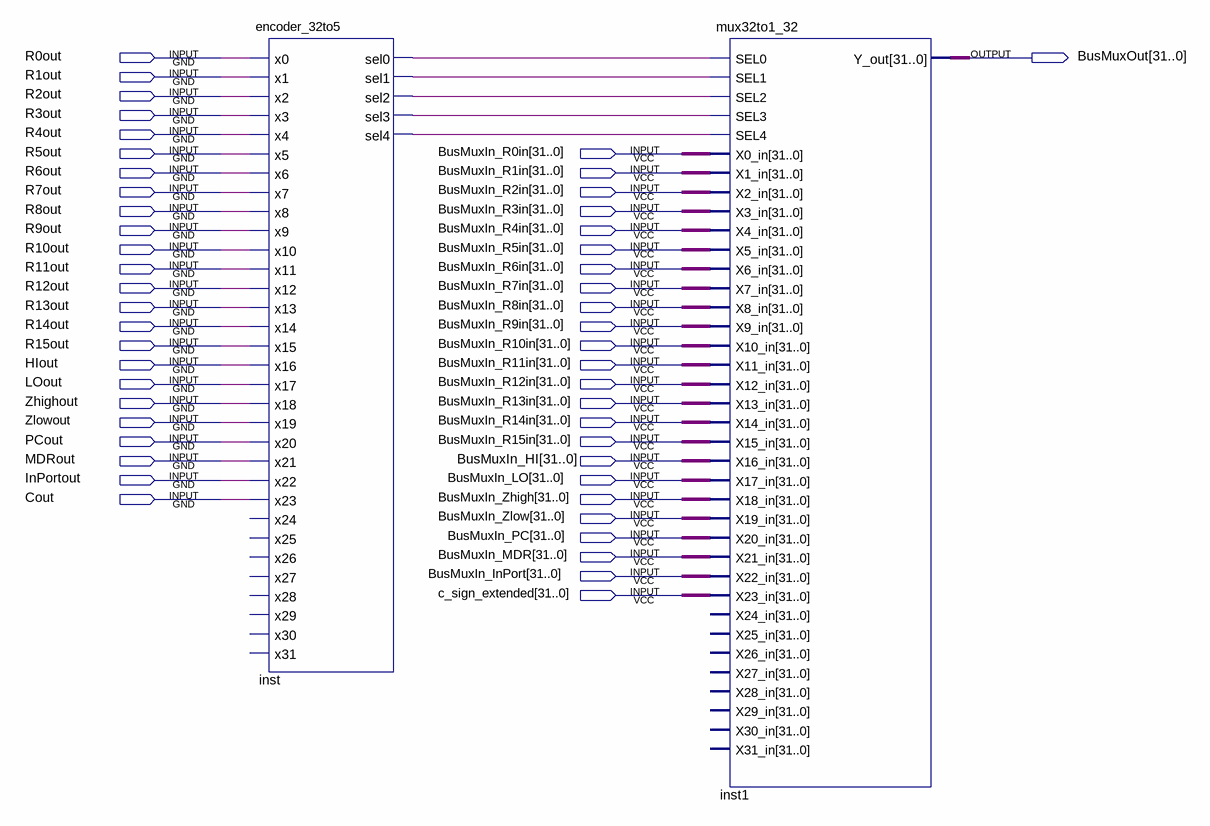
[diagram p0: schematic sheet]
// Quartus schematic bidirectional_bus_design.bdf as structural Verilog: 2 symbols, 49 pins
module bidirectional_bus_design (
  input  R0out,
  input  R1out,
  input  R2out,
  input  R3out,
  input  R4out,
  input  R5out,
  input  [31:0] BusMuxIn_R0in,
  input  R6out,
  input  [31:0] BusMuxIn_R1in,
  input  R7out,
  input  [31:0] BusMuxIn_R2in,
  input  R8out,
  input  [31:0] BusMuxIn_R3in,
  input  R9out,
  input  [31:0] BusMuxIn_R4in,
  input  R10out,
  input  [31:0] BusMuxIn_R5in,
  input  R11out,
  input  [31:0] BusMuxIn_R6in,
  input  R12out,
  input  [31:0] BusMuxIn_R7in,
  input  R13out,
  input  [31:0] BusMuxIn_R8in,
  input  R14out,
  input  [31:0] BusMuxIn_R9in,
  input  R15out,
  input  [31:0] BusMuxIn_R10in,
  input  HIout,
  input  [31:0] BusMuxIn_R11in,
  input  LOout,
  input  [31:0] BusMuxIn_R12in,
  input  Zhighout,
  input  [31:0] BusMuxIn_R13in,
  input  Zlowout,
  input  [31:0] BusMuxIn_R14in,
  input  PCout,
  input  [31:0] BusMuxIn_R15in,
  input  MDRout,
  input  [31:0] BusMuxIn_HI,
  input  InPortout,
  input  [31:0] BusMuxIn_LO,
  input  Cout,
  input  [31:0] BusMuxIn_Zhigh,
  input  [31:0] BusMuxIn_Zlow,
  input  [31:0] BusMuxIn_PC,
  input  [31:0] BusMuxIn_MDR,
  input  [31:0] BusMuxIn_InPort,
  input  [31:0] c_sign_extended,
  output [31:0] BusMuxOut
);

  wire inst_sel0, inst_sel1, inst_sel2, inst_sel3, inst_sel4;

  encoder_32to5 inst (
    .x0(R0out), .x1(R1out), .x2(R2out), .x3(R3out), .x4(R4out), .x5(R5out), .x6(R6out), .x7(R7out),
    .x8(R8out), .x9(R9out), .x10(R10out), .x11(R11out), .x12(R12out), .x13(R13out), .x14(R14out),
    .x15(R15out), .x16(HIout), .x17(LOout), .x18(Zhighout), .x19(Zlowout), .x20(PCout), .x21(MDRout),
    .x22(InPortout), .x23(Cout), .sel0(inst_sel0), .sel1(inst_sel1), .sel2(inst_sel2), .sel3(inst_sel3),
    .sel4(inst_sel4));  // open: x24, x25, x26, x27, x28, x29, x30, x31
  mux32to1_32 inst1 (
    .SEL0(inst_sel0), .SEL1(inst_sel1), .SEL2(inst_sel2), .SEL3(inst_sel3), .SEL4(inst_sel4),
    .X0_in(BusMuxIn_R0in), .X1_in(BusMuxIn_R1in), .X2_in(BusMuxIn_R2in), .X3_in(BusMuxIn_R3in),
    .X4_in(BusMuxIn_R4in), .X5_in(BusMuxIn_R5in), .X6_in(BusMuxIn_R6in), .X7_in(BusMuxIn_R7in),
    .X8_in(BusMuxIn_R8in), .X9_in(BusMuxIn_R9in), .X10_in(BusMuxIn_R10in), .X11_in(BusMuxIn_R11in),
    .X12_in(BusMuxIn_R12in), .X13_in(BusMuxIn_R13in), .X14_in(BusMuxIn_R14in), .X15_in(BusMuxIn_R15in),
    .X16_in(BusMuxIn_HI), .X17_in(BusMuxIn_LO), .X18_in(BusMuxIn_Zhigh), .X19_in(BusMuxIn_Zlow),
    .X20_in(BusMuxIn_PC), .X21_in(BusMuxIn_MDR), .X22_in(BusMuxIn_InPort), .X23_in(c_sign_extended),
    .Y_out(BusMuxOut));  // open: X24_in, X25_in, X26_in, X27_in, X28_in, X29_in, X30_in, X31_in
endmodule
